# Altium schematic sheet - COVER PAGE.SchDoc
size A4; SheetNumber: 1; SheetTotal: 4; ENG_APP_DATE: --/--/--; DSN_APP_DATE: --/--/--; CHK_APP_DATE: --/--/--
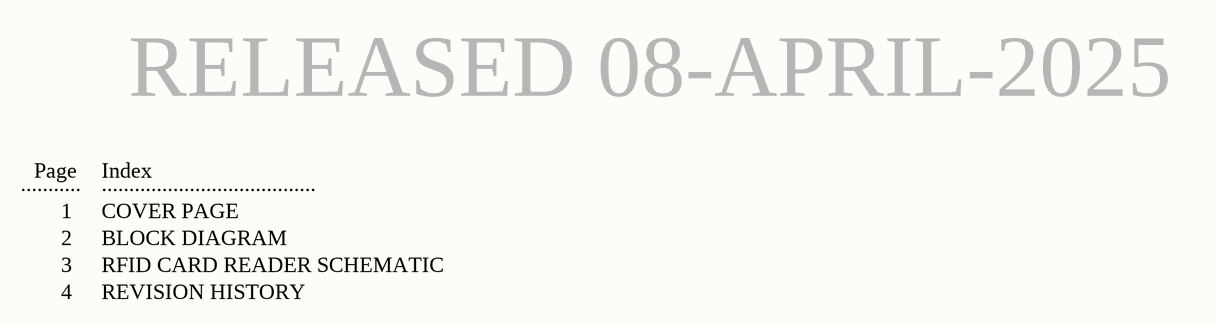
[diagram p0: - COVER PAGE.SchDoc]

## Notes on the sheet
- RELEASED 08-APRIL-2025
- ...........
- Page
- Index
- .......................................
- 1
- 2
- 3
- COVER PAGE
- BLOCK DIAGRAM
- RFID CARD READER SCHEMATIC
- 4
- REVISION HISTORY
- Title: RFID Card Reader
- Ho Chi Minh city University of Technology
- Desc: Group 12
- Designed by:
- Checked by:
- Approved by: NiL
- Date:
- Sheet:
- Document No:
- Revision:
- Size:
- 1.1.1